# Altium schematic sheet displays.SchDoc
size 209 x 297 mm; DocumentCode: Децимальный номер; SchemeType: Схема электрическая принципиальная; TitleLine1: Название проекта (строка 1); TitleLine2: Название проекта (строка 2); PageSetup: Record=PageOptionsZCenterHorizontal=TrueZCenterVertical=TrueZPrintScale=0.95ZXCorrection=1.00ZYCorrection=1.00ZPrintKind=2ZBorderSize=5000000ZLeftOffset=0ZBottomOffset=0ZOrientation=1ZPaperLength=1000ZPaperWidth=1000ZScale=100ZPaperSource=7ZPrintQuality=600ZMediaType=1ZDitherType=10ZPaperKind=A4 (210 x 297 мм)ZPrintScaleMode=1
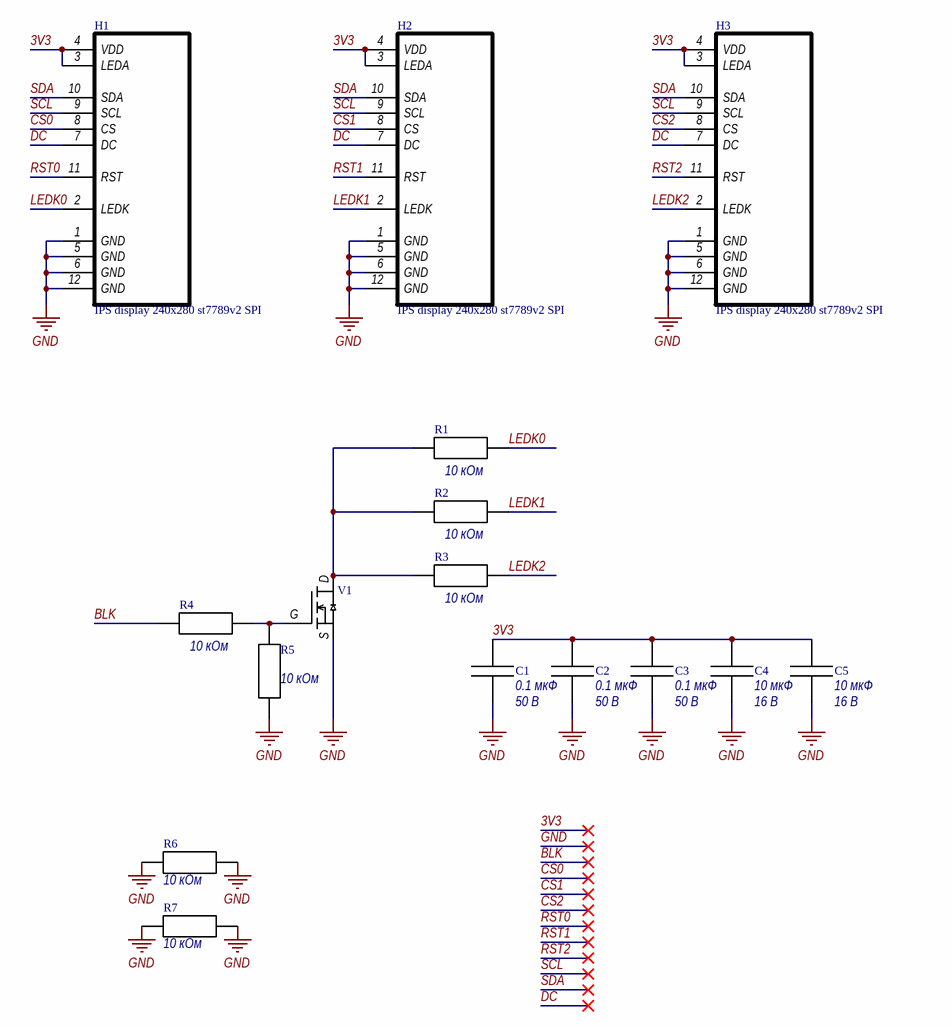
[diagram p0: displays.SchDoc]

## Parts
C1  value 0.1 мкФ  Voltage: 50 В  [0805-CAP]  (hidden comment: GRM21BR71H104K)
C2  value 0.1 мкФ  Voltage: 50 В  [0805-CAP]  (hidden comment: GRM21BR71H104K)
C3  value 0.1 мкФ  Voltage: 50 В  [0805-CAP]  (hidden comment: GRM21BR71H104K)
C4  value 10 мкФ  Voltage: 16 В  [0805-CAP]  (hidden comment: GRM21BR61C106K)
C5  value 10 мкФ  Voltage: 16 В  [0805-CAP]  (hidden comment: GRM21BR61C106K)
H1  IPS display 240x280 st7789v2 SPI  [(Требует доработки) IPS display 240x280 st7789v2 SPI]
H2  IPS display 240x280 st7789v2 SPI  [(Требует доработки) IPS display 240x280 st7789v2 SPI]
H3  IPS display 240x280 st7789v2 SPI  [(Требует доработки) IPS display 240x280 st7789v2 SPI]
R1  value 10 кОм  [0805-RES]  (hidden comment: RC0805FR-0710KL)
R2  value 10 кОм  [0805-RES]  (hidden comment: RC0805FR-0710KL)
R3  value 10 кОм  [0805-RES]  (hidden comment: RC0805FR-0710KL)
R4  value 10 кОм  [0805-RES]  (hidden comment: RC0805FR-0710KL)
R5  value 10 кОм  [0805-RES]  (hidden comment: RC0805FR-0710KL)
R6  value 10 кОм  [0805-RES]  (hidden comment: RC0805FR-0710KL)
R7  value 10 кОм  [0805-RES]  (hidden comment: RC0805FR-0710KL)
V1  IRLML2030TRPBF  [SOT-23-3]  (value not drawn)

## Nets
GND: C1.1 C2.1 C3.1 C4.1 C5.1 H1.1(GND) H1.5(GND) H1.6(GND) H1.12(GND) H2.1(GND) H2.5(GND) H2.6(GND) H2.12(GND) H3.1(GND) H3.5(GND) H3.6(GND) H3.12(GND) R5.1 R6.1 R6.2 R7.1 R7.2 V1.S
3V3: C1.2 C2.2 C3.2 C4.2 C5.2 H1.3(LEDA) H1.4(VDD) H2.3(LEDA) H2.4(VDD) H3.3(LEDA) H3.4(VDD)
BLK: R4.1
CS0: H1.8(CS)
CS1: H2.8(CS)
CS2: H3.8(CS)
DC: H1.7(DC) H2.7(DC) H3.7(DC)
LEDK0: H1.2(LEDK) R1.1
LEDK1: H2.2(LEDK) R2.1
LEDK2: H3.2(LEDK) R3.1
RST0: H1.11(RST)
RST1: H2.11(RST)
RST2: H3.11(RST)
SCL: H1.9(SCL) H2.9(SCL) H3.9(SCL)
SDA: H1.10(SDA) H2.10(SDA) H3.10(SDA)
NetR1_2: R1.2 R2.2 R3.2 V1.D
NetR4_2: R4.2 R5.2 V1.G

## Notes on the sheet
- Перв. примен.
- Справ. №
- Подп. и дата
- Инв. № дубл.
- Взам. инв. №
- Разраб.
- Изм.
- Лист
- № докум.
- Подп.
- Дата
- Лит.
- Масса
- Масштаб
- Пров.
- Т. контр.
- Листов
- Н. контр.
- Утв.
- Нач. лаб.
- Инв. № подл.
- Копировал
- Формат А4

## Library data of the parts
C1-C3 = CMP-0544-A.1: Конденсатор керамический, 0.1 мкФ, X7R, 50 В, точность 10%, 0805; Accuracy: 10%
C4 C5 = CMP-0164-A.4: Конденсатор керамичеcкий, 10 мкФ, X5R, 16 В, точность 10%, 0805; Manufacturer: Murata; Accuracy: 10 %
H1-H3 = CMP-0733-A.1: Дисплей цветной, 1.69 дюйма, 240 x 280 точки, IPS, LH169T-IG01; Manufacturer: NA; Temperature: NA
R1-R7 = CMP-0677-A.2: Резистор, 10 кОм, 0.125 Вт, точность 1%, 0805; Accuracy: 1%
V1 = CMP-0630-A.1: N-канальный транзистор, 30 в, 100 мОм(10 в), 2.7 а; Manufacturer: International Rectifier; Temperature: -55 - 150°C